# Altium schematic sheet power.SchDoc
size A4
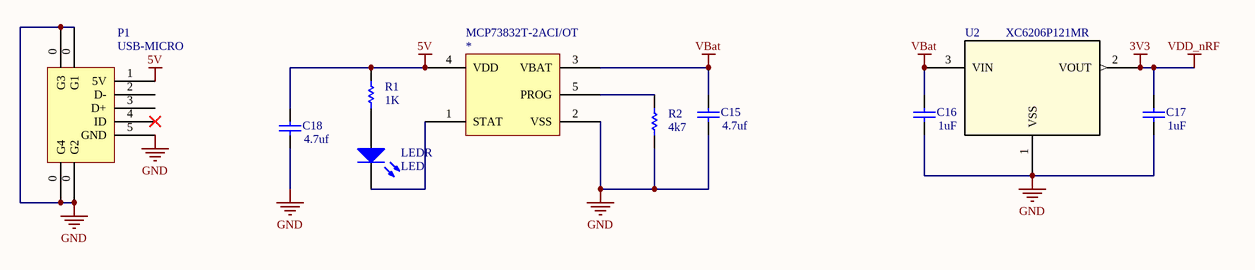
[diagram p0: power.SchDoc]

## Parts
*  MCP73832T-2ACI/OT  [SOT-23-OT5_M]
C15  value 4.7uf  [C0603]  (hidden comment: Cap Semi)
C16  value 1uF  [C0603]  (hidden comment: Cap Semi)
C17  value 1uF  [C0603]  (hidden comment: Cap Semi)
C18  value 4.7uf  [C0603]  (hidden comment: Cap Semi)
LEDR  LED  [0603]
P1  USB-MICRO  [USB-MICRO]
R1  value 1K  [R0603-M]  (hidden comment: Resistors SMD)
R2  value 4k7  [R0603-M]  (hidden comment: Resistors SMD)
U2  XC6206P121MR  [SOT-23]

## Nets
3V3: C17.2 U2.2(VOUT)  [also labelled VDD_nRF]
5V: *.4(VDD) C18.2 P1.1(5V) R1.2
GND: *.2(VSS) C15.1 C16.1 C17.1 C18.1 P1.0(G1) P1.5(GND) R2.1 U2.1(VSS)
VBat: *.3(VBAT) C15.2 C16.2 U2.3(VIN)
Net*_1: *.1(STAT) LEDR.2(K)
Net*_5: *.5(PROG) R2.2
NetLEDR_1: LEDR.1(A) R1.1

Not connected (* = marked no-connect by the designer): P1 2(D-) 3(D+) 4(ID)*

## Library data of the parts
C15-C18 = Cap Semi: Capacitor (Semiconductor SIM Model); Published: 8-Jun-2000; LatestRevisionDate: 29-May-2009; LatestRevisionNote: IPC-7351 Footprint Added.; PackageReference: C1206; Publisher: Altium Limited; PackageDescription: Chip Capacitor
LEDR = LED: Typical INFRARED GaAs LED; Published: 8-Jun-2000; LatestRevisionDate: 08-Jul-2005; LatestRevisionNote: Mech Layer 1 removed.; PackageReference: LED-0; Publisher: Altium Limited; PackageDescription: LED; 2 Leads
R1 R2 = Resistors SMD: Resistor
U2 = XC6206P121MR: Imported; Vendor: Torex Semiconductor; Built_By: EMA_UL_Team; C: Copyright (C) 2016 Accelerated Designs. All rights reserved; Manufacturer_Part_Number: XC6206P121MR; RefDes: RefDes; Type: DEV; Value: Value